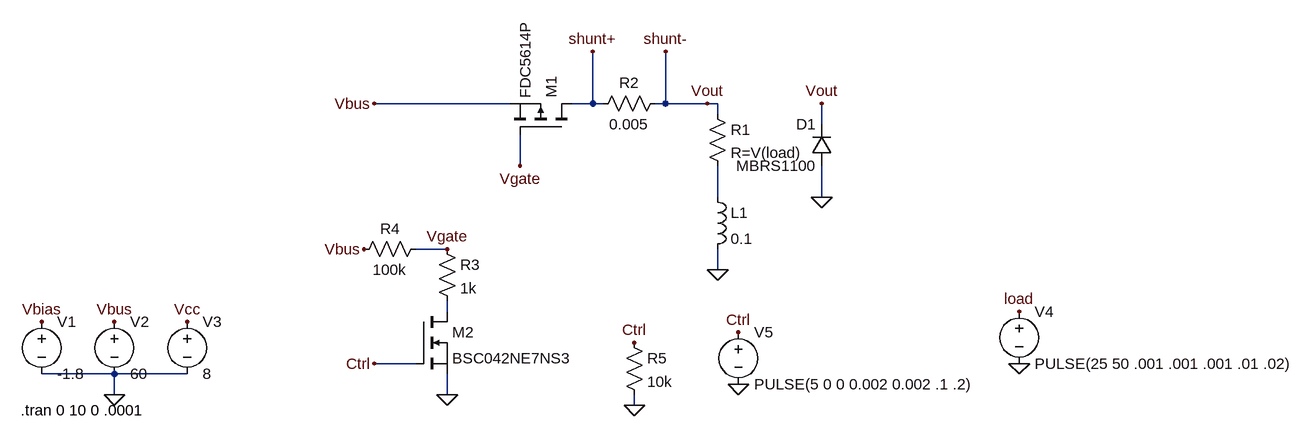
[diagram p0: schematic HighSideDriver.asc]
HighSideDriver.asc, the LTspice schematic file:
Version 4.1
SHEET 1 1744 680
WIRE 512 -192 304 -192
WIRE 640 -192 640 -272
WIRE 640 -192 608 -192
WIRE 656 -192 640 -192
WIRE 752 -192 752 -272
WIRE 752 -192 736 -192
WIRE 816 -192 752 -192
WIRE 832 -192 816 -192
WIRE 832 -176 832 -192
WIRE 992 -160 992 -192
WIRE 528 -96 528 -144
WIRE 832 -48 832 -96
WIRE 992 -48 992 -96
WIRE 416 32 368 32
WIRE 832 64 832 32
WIRE 416 128 416 112
WIRE 368 208 304 208
WIRE -96 224 -208 224
WIRE 16 224 -96 224
WIRE -96 256 -96 224
WIRE 416 256 416 224
WIRE 704 272 704 256
FLAG -96 256 0
FLAG -96 144 Vbus
FLAG 16 144 Vcc
FLAG -208 144 Vbias
FLAG 304 -192 Vbus
FLAG 816 -192 Vout
FLAG 528 -96 Vgate
FLAG 992 -192 Vout
FLAG 992 -48 0
FLAG 416 32 Vgate
FLAG 288 32 Vbus
FLAG 416 256 0
FLAG 304 208 Ctrl
FLAG 704 176 Ctrl
FLAG 704 272 0
FLAG 1296 208 0
FLAG 1296 128 load
FLAG 864 240 0
FLAG 864 160 Ctrl
FLAG 640 -272 shunt+
FLAG 752 -272 shunt-
FLAG 832 64 0
SYMBOL voltage -208 128 R0
WINDOW 123 0 0 Left 0
WINDOW 39 0 0 Left 0
SYMATTR InstName V1
SYMATTR Value -1.8
SYMBOL voltage -96 128 R0
WINDOW 123 0 0 Left 0
WINDOW 39 0 0 Left 0
SYMATTR InstName V2
SYMATTR Value 60
SYMBOL voltage 16 128 R0
WINDOW 123 0 0 Left 0
WINDOW 39 0 0 Left 0
SYMATTR InstName V3
SYMATTR Value 8
SYMBOL pmos 608 -144 M270
SYMATTR InstName M1
SYMATTR Value FDC5614P
SYMBOL res 816 -192 R0
SYMATTR InstName R1
SYMATTR Value R=V(load)
SYMBOL res 752 -208 R90
WINDOW 0 0 56 VBottom 2
WINDOW 3 32 56 VTop 2
SYMATTR InstName R2
SYMATTR Value 0.005
SYMBOL diode 1008 -96 R180
WINDOW 0 24 64 Left 2
WINDOW 3 24 0 Left 2
SYMATTR InstName D1
SYMATTR Value MBRS1100
SYMATTR Description Diode
SYMATTR Type diode
SYMBOL res 400 16 R0
SYMATTR InstName R3
SYMATTR Value 1k
SYMBOL res 384 16 R90
WINDOW 0 0 56 VBottom 2
WINDOW 3 32 56 VTop 2
SYMATTR InstName R4
SYMATTR Value 100k
SYMBOL nmos 368 128 R0
SYMATTR InstName M2
SYMATTR Value BSC042NE7NS3
SYMBOL res 688 160 R0
SYMATTR InstName R5
SYMATTR Value 10k
SYMBOL voltage 1296 112 R0
WINDOW 123 0 0 Left 0
WINDOW 39 0 0 Left 0
SYMATTR InstName V4
SYMATTR Value PULSE(25 50 .001 .001 .001 .01 .02)
SYMBOL voltage 864 144 R0
WINDOW 123 0 0 Left 0
WINDOW 39 0 0 Left 0
SYMATTR InstName V5
SYMATTR Value PULSE(5 0 0 0.002 0.002 .1 .2)
SYMBOL ind 816 -64 R0
SYMATTR InstName L1
SYMATTR Value 0.1
TEXT -240 280 Left 2 !.tran 0 10 0 .0001

The netlist it stands for:
* HighSideDriver.asc
V1 Vbias 0 -1.8
V2 Vbus 0 60
V3 Vcc 0 8
M1 shunt+ Vgate Vbus Vbus FDC5614P
R1 shunt- N001 R=V(load)
R2 shunt- shunt+ 0.005
D1 0 shunt- MBRS1100
R3 Vgate N002 1k
R4 Vgate Vbus 100k
M2 N002 Ctrl 0 0 BSC042NE7NS3
R5 Ctrl 0 10k
V4 load 0 PULSE(25 50 .001 .001 .001 .01 .02)
V5 Ctrl 0 PULSE(5 0 0 0.002 0.002 .1 .2)
L1 N001 0 0.1
.model D D
.lib standard.dio
.model NMOS NMOS
.model PMOS PMOS
.lib standard.mos
.tran 0 10 0 .0001
.backanno
.end